# Altium schematic sheet mcu_power.SchDoc
size A4; DocumentNumber: 1; SheetNumber: 1; SheetTotal: 3
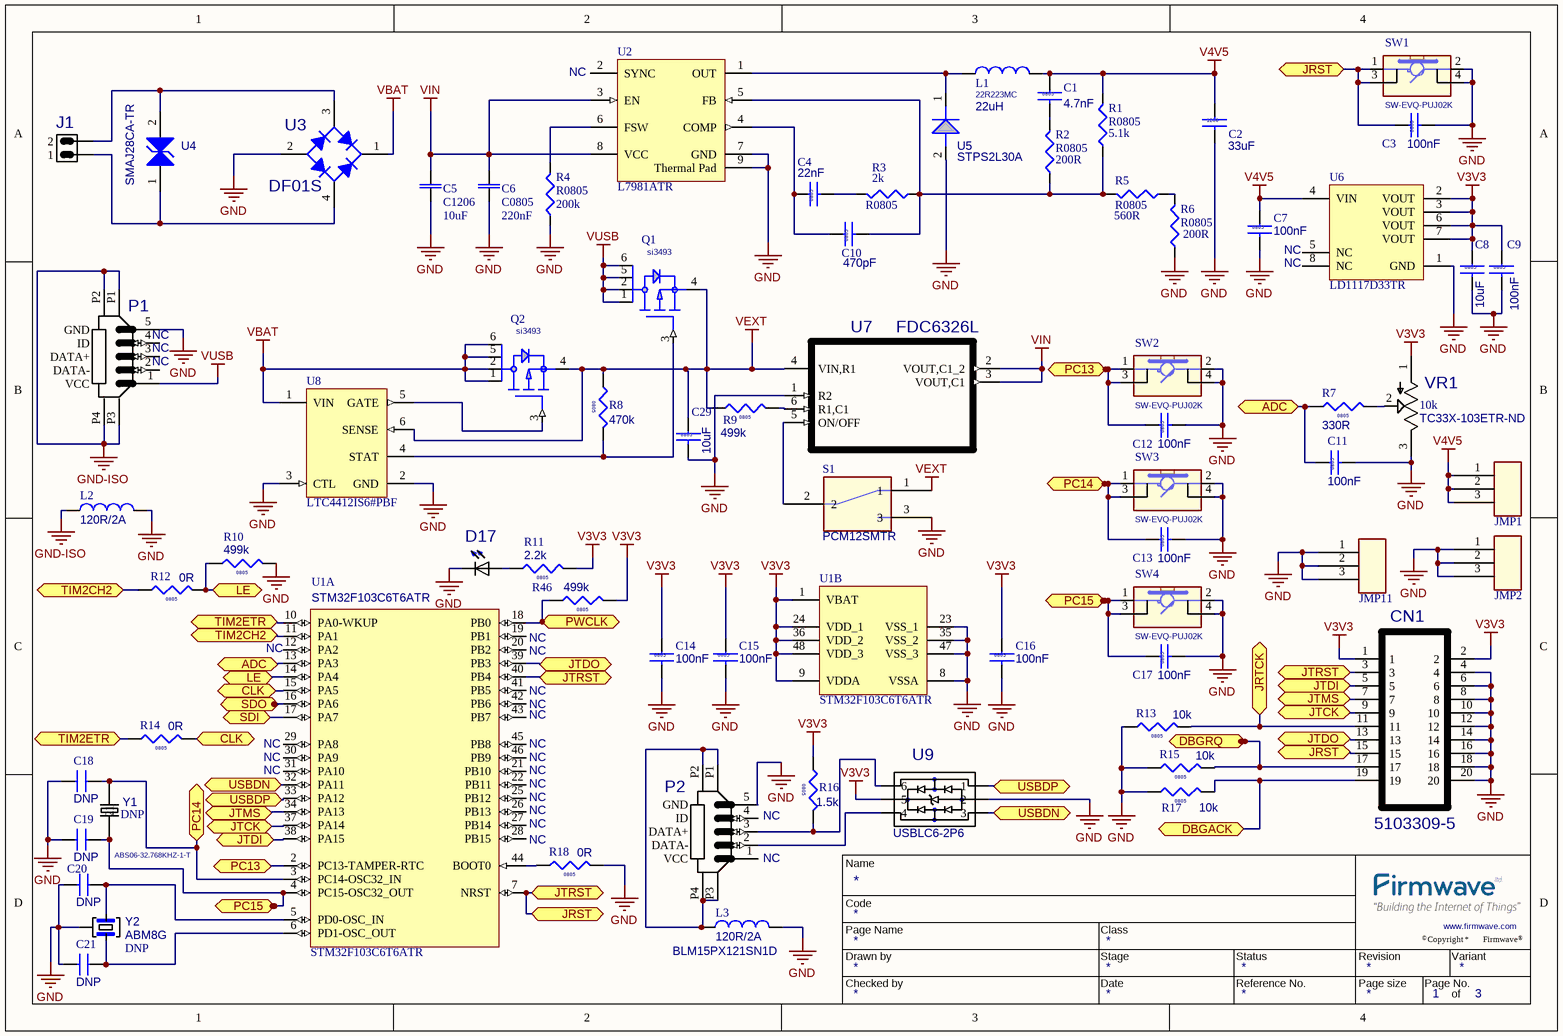
[diagram p0: mcu_power.SchDoc]

## Parts
C1  value 4.7nF  [C0805]  (hidden comment: EYLVWUPD)
C2  value 33uF  [C1206]  (hidden comment: ?)
C3  value 100nF  [C0805]  (hidden comment: GRM219R71C104KA01D)
C4  value 22nF  [C0805]  (hidden comment: ?)
C5  C1206  value 10uF  [C1206]
C6  C0805  value 220nF  [C0805]
C7  value 100nF  [C0805]  (hidden comment: GRM219R71C104KA01D)
C8  value 10uF  [C0805]  (hidden comment: GRM21BR61C106KE15L)
C9  value 100nF  [C0805]  (hidden comment: GRM219R71C104KA01D)
C10  value 470pF  [C0805]  (hidden comment: ?)
C11  value 100nF  [C0805]  (hidden comment: GRM219R71C104KA01D)
C12  value 100nF  [C0805]  (hidden comment: GRM219R71C104KA01D)
C13  value 100nF  [C0805]  (hidden comment: GRM219R71C104KA01D)
C14  value 100nF  [C0805]  (hidden comment: GRM219R71C104KA01D)
C15  value 100nF  [C0805]  (hidden comment: GRM219R71C104KA01D)
C16  value 100nF  [C0805]  (hidden comment: GRM219R71C104KA01D)
C17  value 100nF  [C0805]  (hidden comment: GRM219R71C104KA01D)
C18  value DNP  [0402]  (hidden comment: 0402)
C19  value DNP  [0402]  (hidden comment: 0402)
C20  value DNP  [0402]  (hidden comment: 0402)
C21  value DNP  [0402]  (hidden comment: 0402)
C29  value 10uF  [C0805]  (hidden comment: GRM21BR61C106KE15L)
CN1  5103309-5  [TYCO_5103309-5]
D17  LTST-C170KGKT  [DIOC200X125X110_LTST-C170KGKT(Primary)]  (value not drawn)
J1  640455-2  [2-PIN_CONNECTOR]  (value not drawn)
JMP1  JUMPER  [CON-HDR_3X1X254]  (value not drawn)
JMP2  JUMPER  [CON-HDR_3X1X254]  (value not drawn)
JMP11  JUMPER  [CON-HDR_3X1X254]  (value not drawn)
L1  22R223MC  value 22uH  [22R223MC]
L2  value 120R/2A  [0402]  (hidden comment: L0402)
L3  value 120R/2A  [0402]  (hidden comment: L0402)
P1  440247-2  [TE_440247-2]  (value not drawn)
P2  440247-2  [TE_440247-2]  (value not drawn)
Q1  si3493  [TSOP-6]
Q2  si3493  [TSOP-6]
R1  R0805  value 5.1k  [R0805]
R2  R0805  value 200R  [R0805]
R3  R0805  value 2k  [R0805]
R4  R0805  value 200k  [R0805]
R5  R0805  value 560R  [R0805]
R6  R0805  value 200R  [R0805]
R7  value 330R  [R0805]  (hidden comment: ?)
R8  value 470k  [R0805]  (hidden comment: ?)
R9  value 499k  [R0805]  (hidden comment: ?)
R10  value 499k  [R0805]  (hidden comment: ?)
R11  value 2.2k  [R0805]  (hidden comment: ?)
R12  value 0R  [R0805]  (hidden comment: ?)
R13  value 10k  [R0805]  (hidden comment: ?)
R14  value 0R  [R0805]  (hidden comment: ?)
R15  value 10k  [R0805]  (hidden comment: ?)
R16  value 1.5k  [R0805]  (hidden comment: ?)
R17  value 10k  [R0805]  (hidden comment: ?)
R18  value 0R  [R0805]  (hidden comment: ?)
R46  value 499k  [R0805]  (hidden comment: ?)
S1  SW_ON_OFF_Mini  [PCM12SMTR]  (value not drawn)
SW1  SW-EVQ-PUJ02K  [EVQPUJ02K]
SW2  SW-EVQ-PUJ02K  [EVQPUJ02K]
SW3  SW-EVQ-PUJ02K  [EVQPUJ02K]
SW4  SW-EVQ-PUJ02K  [EVQPUJ02K]
U1  STM32F103C6T6ATR  [STM-LQFP48_N]  (parts A,B of 2)
U2  L7981ATR  [HSOP8-D1_N]
U3  DF01S  [SOT508P985X260-4N]
U4  SMAJ28CA-TR  [DO-214AA]
U5  STPS2L30A  [DO-214AA]
U6  LD1117D33TR  [SO8_N]
U7  FDC6326L  [SOT95P280X110-6N]
U8  LTC4412IS6#PBF  [LT-S6-6-TSOT-23_N]
U9  USBLC6-2  [USBLC6-2P6]  (value not drawn)
VR1  value 10k  Supplier Part Number: TC33X-103ETR-ND  [TRIM_TC33X-2-103E]  (hidden comment: TC33X-2-103E)
Y1  ABS06-32.768KHZ-1-T  value DNP  [XTAL_ABS06-32.768KHZ-1-T]
Y2  ABM8G  value DNP  [ABM8G_ABM8G(Primary)]

## Ports
ADC, CLK, DBGACK, DBGRQ, JRST, JRTCK, JTCK, JTDI, JTDO, JTMS, JTRST, LE, PC13, PC14, PC15, PWCLK, SDI, SDO, TIM2CH2, TIM2ETR, USBDN, USBDP

## Nets
GND: C2.2 C3.2 C5.1 C6.1 C7.2 C8.2 C9.2 C11.2 C12.2 C13.2 C14.2 C15.2 C16.2 C17.2 C18.1 C19.1 C20.1 C21.1 C29.2 CN1.4 CN1.6 CN1.8 CN1.10 CN1.12 CN1.14 CN1.16 CN1.18 CN1.20 D17.1 JMP2.1 JMP2.2 JMP2.3 JMP11.1 JMP11.2 JMP11.3 L2.2 L3.2 P1.5(GND) P2.5(GND) R4.1 R6.1 R10.2 R13.1 R15.1 R17.1 R18.2 S1.3 SW1.2 SW1.4 SW2.2 SW2.4 SW3.2 SW3.4 SW4.2 SW4.4 U1.8(VSSA) U1.23(VSS_1) U1.35(VSS_2) U1.47(VSS_3) U2.7(GND) U2.9(Thermal_Pad) U3.2(A) U5.2(ANODE) U6.1(GND) U7.1(R2) U8.2(GND) U8.3(CTL) U9.2 VR1.3 Y2.2_4
GND-ISO: L2.1 P1.P1(GND) P1.P2(GND) P1.P3(GND) P1.P4(GND)
V3V3: C8.1 C9.1 C14.1 C15.1 C16.1 CN1.1 CN1.2 R11.2 R16.1 R46.2 U1.1(VBAT) U1.9(VDDA) U1.24(VDD_1) U1.36(VDD_2) U1.48(VDD_3) U6.2(VOUT) U6.3(VOUT) U6.6(VOUT) U6.7(VOUT) U9.5 VR1.1
V4V5: C1.1 C2.1 C7.1 JMP1.1 JMP1.2 JMP1.3 L1.2 R1.2 U6.4(VIN)
VBAT: Q2.1(D) Q2.2(D) Q2.5(D) Q2.6(D) U3.1(K) U8.1(VIN)
VEXT: C29.1 Q1.4(S) Q2.4(S) R8.1 R9.1 S1.1 U7.4(VIN,R1) U8.6(SENSE)
VIN: C5.2 C6.2 U2.3(EN) U2.8(VCC) U7.2(VOUT,C1_2) U7.3(VOUT,C1)
VUSB: P1.1(VCC) Q1.1(D) Q1.2(D) Q1.5(D) Q1.6(D)
ADC: C11.1 R7.1 U1.13(PA3) ; port ADC
CLK: R14.2 U1.15(PA5) ; port CLK
DBGACK: CN1.19 R17.2 ; port DBGACK
DBGRQ: CN1.17 R15.2 ; port DBGRQ
JRST: C3.1 CN1.3 CN1.15 SW1.1 SW1.3 U1.7(NRST) U1.40(PB4) ; port JTRST, port JRST
JRTCK: CN1.11 R13.2 ; port JRTCK
JTCK: CN1.9 U1.37(PA14) ; port JTCK
JTDI: CN1.5 U1.38(PA15) ; port JTDI
JTDO: CN1.13 U1.39(PB3) ; port JTDO
JTMS: CN1.7 U1.34(PA13) ; port JTMS
LE: R10.1 R12.2 U1.14(PA4) ; port LE
PC13: C12.1 SW2.1 SW2.3 U1.2(PC13-TAMPER-RTC) ; port PC13
PC14: C13.1 C18.2 SW3.1 SW3.3 U1.3(PC14-OSC32_IN) Y1.1 ; port PC14
PC15: C17.1 C19.2 SW4.1 SW4.3 U1.4(PC15-OSC32_OUT) Y1.2 ; port PC15
PWCLK: R46.1 U1.18(PB0) ; port PWCLK
SDI: U1.17(PA7) ; port SDI
SDO: U1.16(PA6) ; port SDO
TIM2CH2: R12.1 U1.11(PA1) ; port TIM2CH2
TIM2ETR: R14.1 U1.10(PA0-WKUP) ; port TIM2ETR
USBDN: U1.32(PA11) U9.3 ; port USBDN
USBDP: U1.33(PA12) U9.1 ; port USBDP
NetC1_2: C1.2 R2.2
NetC4_1: C4.1 C10.1 U2.4(COMP)
NetC4_2: C4.2 R3.2
NetC10_2: C10.2 R1.1 R2.1 R3.1 R5.2 U2.5(FB)
NetC20_2: C20.2 U1.5(PD0-OSC_IN) Y2.1
NetC21_2: C21.2 U1.6(PD1-OSC_OUT) Y2.3
NetD17_2: D17.2 R11.1
NetJ1_1: J1.1 U3.4(C) U4.1(C)
NetJ1_2: J1.2 U3.3(C) U4.2(C)
NetL1_1: L1.1 U2.1(OUT) U5.1(CATHODE)
NetL3_1: L3.1 P2.P1(GND) P2.P2(GND) P2.P3(GND) P2.P4(GND)
NetP2_2: P2.2(DATA-) U9.4
NetP2_3: P2.3(DATA+) R16.2 U9.6
NetQ1_3: Q1.3(G) R8.2 U8.4(STAT)
NetQ2_3: Q2.3(G) U8.5(GATE)
NetR4_2: R4.2 U2.6(FSW)
NetR5_1: R5.1 R6.2
NetR7_2: R7.2 VR1.2
NetR9_2: R9.2 U7.6(R1,C1)
NetR18_1: R18.1 U1.44(BOOT0)
NetS1_2: S1.2 U7.5(ON/OFF)

Not connected (* = marked no-connect by the designer): P1 2(DATA-) 3(DATA+) 4(ID); P2 1(VCC) 4(ID); U1 12(PA2) 19(PB1) 20(PB2) 21(PB10) 22(PB11) 25(PB12) 26(PB13) 27(PB14) 28(PB15) 29(PA8) 30(PA9) 31(PA10) 41(PB5) 42(PB6) 43(PB7) 45(PB8) 46(PB9); U2 2(SYNC); U6 5(NC) 8(NC)

## Notes on the sheet
- (near U2) NC
- NC
- (near P1) NC
- (near U1) NC
- (near P2) NC
- Name
- Code
- Page Name
- Drawn by
- Checked by
- Class
- Stage
- Date
- Status
- Reference No.
- Revision
- Page size
- ©
- Page No.
- Copyright
- www.firmwave.com
- Variant
- Firmwave
- ®
- of
- (in symbol CAP0805) 0805
- (in symbol CAP1206) 1206

## Library data of the parts
C1 = CAP0805: Manufacturer Part Number: JMK212BJ476MG-T; Manufacturer: Taiyo Yuden; Voltage - Rated: 6.3V; Tolerance: ±20%; Temperature Coefficient: X5R; Capacitance: 47µF; PARTTYPE: CAP0805; Applications: General Purpose; Category: Capacitors; Failure Rate: *; Supplier: Digi-Key; Lead Spacing: -; RoHS: RoHS Compliant; Height - Seated (Max): -; Part Status: Active; Ratings: -; Thickness (Max): 0.053" (1.35mm); Package / Case: 0805 (2012 Metric); Operating Temperature: -55°C ~ 85°C; Packaging: Tape & Reel (TR); Mounting Type: Surface Mount, MLCC; Size / Dimension: 0.079" L x 0.049" W (2.00mm x 1.25mm); Features: -; Supplier Part Number: 587-1779-2-ND; Lead Style: -
C2 = CAP1206: SELC PartNumber: SE; Manufacturer: TDK Corporation; Manufacturer Part Number: C3216X5R1C336M160AB; Tolerance: ±20%; Temperature Coefficient: X5R; Voltage - Rated: 16V; Capacitance: 33µF; PARTTYPE: CAP1206; Failure Rate: -; Lead Spacing: -; Thickness (Max): 0.071" (1.80mm); Lead Style: -; Package / Case: 1206 (3216 Metric); Mounting Type: Surface Mount, MLCC; Height - Seated (Max): -; Applications: General Purpose; Size / Dimension: 0.126" L x 0.063" W (3.20mm x 1.60mm); Category: Capacitors; Supplier Part Number: 445-6002-2-ND; Supplier: Digi-Key; Ratings: -; Features: Low ESL; RoHS: RoHS Compliant; Packaging: Tape & Reel (TR); Part Status: Active; Operating Temperature: -55°C ~ 85°C
C3 C7 C9 C11-C17 = CAP0805: Manufacturer: Murata Electronics North America; Tolerance: ±10%; Voltage - Rated: 16V; Capacitance: 0.10µF; Temperature Coefficient: X7R; PARTTYPE: CAP0805; Thickness (Max): 0.037" (0.95mm); Lead Spacing: -; Height - Seated (Max): -; Lead Style: -; Category: Capacitors; Size / Dimension: 0.079" L x 0.049" W (2.00mm x 1.25mm); RoHS: RoHS Compliant; Features: -; Operating Temperature: -55°C ~ 125°C; Ratings: -; Supplier: Digi-Key; Package / Case: 0805 (2012 Metric); Supplier Part Number: 490-1683-2-ND; Part Status: Active; Manufacturer Part Number: GRM219R71C104KA01D; Failure Rate: *; Packaging: Tape & Reel (TR); Mounting Type: Surface Mount, MLCC; Applications: General Purpose
C4 = CAP0805: Manufacturer Part Number: QMK212B7223KG-T; Manufacturer: Taiyo Yuden; voltage_rating_dc: 250.0; pin_count: 2; capacitance_tolerance: ±10%; dielectric_characteristic: X7R; capacitance: 2.2e-08; dielectric_material: Ceramic; PARTTYPE: CAP0805; rohs_status: Compliant; Supplier: Octopart; Seller Landing  Url: https://octopart.com/click/track?country=PL&ak=8157f166&sig=019f8d3&sid=459&ppid=7073011&vpid=34089162&ct=offers; Supplier Part Number: Digi-Key - 587-1272-1-ND; Manufacturer Part Detail Url: https://octopart.com/click/track?country=PL&ak=8157f166&ct=hyperlinks&sig=081e5d1&sid=18954&ppid=7073011&hlid=9478301; case_package: 0805; Octopart Url: http://octopart.com/qmk212b7223kg-t-taiyo+yuden-7073011; OctopartID: 2a3ee35fe3abf5f9; halogen_free_status: Halogen Free; lifecycle_status: Active
C5 = C1206: Capacitor 1206; Manufacturer: TDK Corporation; Manufacturer Part Number: C3216X5R1H106K160AB; Voltage - Rated: 50V; Tolerance: ±10%; Capacitance: 10µF; Temperature Coefficient: X5R; Published: 14-Jun-2016; LatestRevisionDate: 29-May-2009; LatestRevisionNote: IPC-7351 Footprint Added.; PackageReference: C1206; Publisher: Firmwave Ltd.; PackageDescription: Chip Capacitor; Part Status: Active; Lead Style: -; Category: Capacitors; Operating Temperature: -55°C ~ 85°C; Height - Seated (Max): -; Failure Rate: -; Applications: General Purpose; Thickness (Max): 0.071" (1.80mm); Mounting Type: Surface Mount, MLCC; Packaging: Tape & Reel (TR); Size / Dimension: 0.126" L x 0.063" W (3.20mm x 1.60mm); Lead Spacing: -; Features: Low ESL; Ratings: -; Supplier: Digi-Key; Package / Case: 1206 (3216 Metric); RoHS: RoHS Compliant; Supplier Part Number: 445-5998-2-ND
C6 = C0805: Capacitor 0805; Manufacturer: Taiyo Yuden; Manufacturer Part Number: UMK212B7224KG-T; Voltage - Rated: 50V; Capacitance: 0.22µF; Temperature Coefficient: X7R; Tolerance: ±10%; Published: 8-Jun-2000; LatestRevisionDate: 29-May-2009; LatestRevisionNote: IPC-7351 Footprint Added.; PackageReference: C0805; Publisher: Firmwave Ltd.; PackageDescription: Chip Capacitor; Operating Temperature: -55°C ~ 125°C; Lead Style: -; Lead Spacing: -; Packaging: Tape & Reel (TR); Mounting Type: Surface Mount, MLCC; Failure Rate: *; RoHS: RoHS Compliant; Supplier Part Number: 587-1287-2-ND; Thickness (Max): 0.053" (1.35mm); Ratings: -; Category: Capacitors; Package / Case: 0805 (2012 Metric); Size / Dimension: 0.079" L x 0.049" W (2.00mm x 1.25mm); Features: -; Supplier: Digi-Key; Part Status: Active; Height - Seated (Max): -
C8 C29 = CAP0805: Manufacturer: Murata Electronics North America; Capacitance: 10µF; Temperature Coefficient: X5R; Voltage - Rated: 16V; Tolerance: ±10%; PARTTYPE: CAP0805; Lead Spacing: -; Package / Case: 0805 (2012 Metric); Size / Dimension: 0.079" L x 0.049" W (2.00mm x 1.25mm); Thickness (Max): 0.053" (1.35mm); Height - Seated (Max): -; Mounting Type: Surface Mount, MLCC; Lead Style: -; Ratings: -; Packaging: Tape & Reel (TR); Failure Rate: *; RoHS: RoHS Compliant; Part Status: Active; Applications: General Purpose; Operating Temperature: -55°C ~ 85°C; Features: -; Manufacturer Part Number: GRM21BR61C106KE15L; Category: Capacitors; Supplier: Digi-Key; Supplier Part Number: 490-3886-2-ND
C10 = CAP0805: Manufacturer Part Number: MM051A471JCT2A; Manufacturer: AVX; PARTTYPE: CAP0805; Octopart Url: http://octopart.com/mm051a471jct2a-avx-76677498; Seller Landing  Url: https://octopart.com/click/track?country=PL&ak=8157f166&sig=000a973&sid=2401&ppid=76677498&vpid=277180285&ct=offers; Supplier: Octopart; Supplier Part Number: Mouser - 581-MM051A471JCT2A; OctopartID: 7939b4a15d25a6fe
C18-C21 = C0402_0: Ceramic capacitor/SMT0603/16V/20%; Part: 200xxx; Package: 0402; Decal: 0402
CN1 = 5103309-5: Header; Pin; Vertical; Copper Alloy; Thermoplastic; 20; 0.100 x 0.100 in.; 1 A; MF: TE Connectivity / AMP; MP: 5103309-5; Price: 1.49 USD; Availability: Good; Package: None; Value: *
D17 = LTST-C170KGKT: Green 2 x 1.25 x 1.1 mm 130Â° Water Clear 35 mcd 2 V Surface Mount LED; Manufacturer Part Number: LTST-C170KRKT; MF: Lite-On; MP: LTST-C170KGKT; Price: 0.10 USD; Availability: Good; Package: 0805 Lite-On; Value: *; Manufacturer: Lite-On; RoHS: No; Supplier: Allied; Supplier Part Number: R1038165
J1 = 640455-2: MTA-100 2 Position 2.54 mm Single Row Right Angle Wire to Board Header; MF: TE Connectivity / AMP; Package: None; MP: 640455-2; Availability: Good; Price: 0.05 USD; Value: *
JMP1 JMP2 JMP11 = CON-HDR_3X1X254: PARTTYPE: CON-HDR_3X1X254
L1 = 22R223MC: Manufacturer: Murata Power Solutions; pin_count: 2; inductance: 2.2e-05; packaging: Tape & Reel (TR); Seller Landing  Url: https://octopart.com/click/track?country=PL&ak=8157f166&sig=09f8fcf&sid=459&ppid=49447512&vpid=146941984&ct=offers; OctopartID: 6766ac9ec058b8a1; Octopart Url: http://octopart.com/22r223mc-murata+power+solutions-49447512; Supplier: Octopart; rohs_status: Compliant; Supplier Part Number: Digi-Key - 811-2426-6-ND; Manufacturer Part Number: 22R223MC
L2 L3 = IND0402: BLM15PX121SN1D; SELC PartNumber: SE?; Manufacturer: Murata Electronics North America; Number of Lines: 1; Current Rating (Max): 2A; Filter Type: Power Line; DC Resistance (DCR) (Max): 55 mOhm; Impedance @ Frequency: 120 Ohm @ 100MHz; PARTTYPE: IND00402; PARTYPE: L0402; FOOTPRINT: 0402CS; Size / Dimension: 0.039" L x 0.020" W (1.00mm x 0.50mm); Supplier: Digi-Key; Packaging: Tape & Reel (TR); Package / Case: 0402 (1005 Metric); Mounting Type: Surface Mount; Part Status: Active; Height (Max): 0.022" (0.55mm); Ratings: -; Supplier Part Number: 490-9656-2-ND; Manufacturer Part Number: BLM15PX121SN1D; Operating Temperature: -55°C ~ 125°C; RoHS: RoHS Compliant; Category: Filters
P1 P2 = 440247-2: Universal Serial Bus (USB) Connectors Product Highlights: USB Type = Mini 1 Ports Number of Positions = 5 Right Angle...; Manufacturer: TE Connectivity AMP Connectors; MF: Micross; Connector Type: USB - mini B; Specifications: USB 2.0; Number of Contacts: 5; Number of Ports: 1; Gender: Receptacle; Material Flammability Rating: UL94 V-0; Package: None; MP: 440247-2; Availability: Unavailable; Price: None; Value: *; Contact Finish: Gold; Termination: Solder; Mounting Type: Surface Mount, Right Angle; Part Status: Obsolete; Voltage - Rated: -; Insulation Color: Black; Category: Connectors, Interconnects; Shielding: -; Packaging: Tape & Reel (TR); Shell/Shielding Material: Phosphor Bronze; Operating Temperature: -; Mounting Feature: Horizontal; Features: Board Guide, Solder Retention; RoHS: RoHS non-compliant; Mating Cycles: -; Ingress Protection: -; Supplier Part Number: 440247-2-ND; Supplier: Digi-Key; Current Rating: -; Manufacturer Part Number: 440247-2
Q1 Q2 = SI3493DBV: Manufacturer Part Number: SI3493BDV-T1-E3; Manufacturer: Vishay Siliconix; Vgs(th) (Max) @ Id: 900mV @ 250µA; Power - Max: 2.97W; FET Feature: Standard; Current - Continuous Drain (Id) @ 25°C: 8A (Tc); Rds On (Max) @ Id, Vgs: 27.5 mOhm @ 7A, 4.5V; Drain to Source Voltage (Vdss): 20V; Gate Charge (Qg) @ Vgs: 43.5nC @ 5V; Input Capacitance (Ciss) @ Vds: 1805pF @ 10V; FET Type: MOSFET P-Channel, Metal Oxide; Mounting Type: Surface Mount; Operating Temperature: -55°C ~ 150°C (TJ); Supplier Device Package: 6-TSOP; Package / Case: SOT-23-6 Thin, TSOT-23-6; Supplier: Digi-Key; Part Status: Active; RoHS: RoHS Compliant; Category: Discrete Semiconductor Products; Packaging: Tape & Reel (TR); Supplier Part Number: SI3493BDV-T1-E3TR-ND
R1 = R0805: Manufacturer: Panasonic Electronic Components; Manufacturer Part Number: ERJ-6GEYJ512V; Temperature Coefficient: ±200ppm/°C; Power (Watts): 0.125W, 1/8W; Tolerance: ±5%; Published: 14-Jun-2016; LatestRevisionDate: 29-May-2009; LatestRevisionNote: IPC-7351 Footprint Added.; PackageReference: 0805; Publisher: Firmwave Limited; PackageDescription: Chip Resistor; Failure Rate: -; Number of Terminations: 2; Features: Automotive AEC-Q200; Packaging: Tape & Reel (TR); Size / Dimension: 0.079" L x 0.049" W (2.00mm x 1.25mm); Supplier Part Number: P5.1KATR-ND; Category: Resistors; Supplier Device Package: 0805; Package / Case: 0805 (2012 Metric); RoHS: RoHS Compliant; Part Status: Active; Resistance (Ohms): 5.1k; Supplier: Digi-Key; Operating Temperature: -55°C ~ 155°C; Height - Seated (Max): 0.028" (0.70mm); Composition: Thick Film
R2 = R0805: Manufacturer: Panasonic Electronic Components; Manufacturer Part Number: ERJ-6GEYJ201V; Tolerance: ±5%; Power (Watts): 0.125W, 1/8W; Temperature Coefficient: ±200ppm/°C; Resistance (Ohms): 200; Published: 14-Jun-2016; LatestRevisionDate: 29-May-2009; LatestRevisionNote: IPC-7351 Footprint Added.; PackageReference: 0805; Publisher: Firmwave Limited; PackageDescription: Chip Resistor; Supplier: Digi-Key; Composition: Thick Film; Features: Automotive AEC-Q200; Supplier Part Number: P200ATR-ND; Size / Dimension: 0.079" L x 0.049" W (2.00mm x 1.25mm); Package / Case: 0805 (2012 Metric); Number of Terminations: 2; Failure Rate: -; Category: Resistors; Packaging: Tape & Reel (TR); Supplier Device Package: 0805; Part Status: Active; RoHS: RoHS Compliant; Height - Seated (Max): 0.028" (0.70mm); Operating Temperature: -55°C ~ 155°C
R3 = R0805: Manufacturer Part Number: ERJ-6GEYJ202V; Manufacturer: Panasonic Electronic Components; Temperature Coefficient: ±200ppm/°C; Tolerance: ±5%; Power (Watts): 0.125W, 1/8W; Published: 14-Jun-2016; LatestRevisionDate: 29-May-2009; LatestRevisionNote: IPC-7351 Footprint Added.; PackageReference: 0805; Publisher: Firmwave Limited; PackageDescription: Chip Resistor; Operating Temperature: -55°C ~ 155°C; Number of Terminations: 2; Features: Automotive AEC-Q200; Package / Case: 0805 (2012 Metric); Supplier Device Package: 0805; Size / Dimension: 0.079" L x 0.049" W (2.00mm x 1.25mm); Height - Seated (Max): 0.028" (0.70mm); Failure Rate: -; Supplier Part Number: P2.0KATR-ND; Category: Resistors; Supplier: Digi-Key; Composition: Thick Film; RoHS: RoHS Compliant; Resistance (Ohms): 2k; Part Status: Active; Packaging: Tape & Reel (TR)
R4 = R0805: Manufacturer: Panasonic Electronic Components; Manufacturer Part Number: ERJ-6GEYJ204V; Power (Watts): 0.125W, 1/8W; Temperature Coefficient: ±200ppm/°C; Tolerance: ±5%; Published: 14-Jun-2016; LatestRevisionDate: 29-May-2009; LatestRevisionNote: IPC-7351 Footprint Added.; PackageReference: 0805; Publisher: Firmwave Limited; PackageDescription: Chip Resistor; Packaging: Tape & Reel (TR); Supplier Device Package: 0805; Features: Automotive AEC-Q200; Operating Temperature: -55°C ~ 155°C; Size / Dimension: 0.079" L x 0.049" W (2.00mm x 1.25mm); Category: Resistors; Number of Terminations: 2; Supplier Part Number: P200KATR-ND; Failure Rate: -; Part Status: Active; Package / Case: 0805 (2012 Metric); Resistance (Ohms): 200k; Composition: Thick Film; Supplier: Digi-Key; RoHS: RoHS Compliant; Height - Seated (Max): 0.028" (0.70mm)
R5 = R0805: Manufacturer: Panasonic Electronic Components; Manufacturer Part Number: ERJ-6GEYJ561V; Temperature Coefficient: ±200ppm/°C; Power (Watts): 0.125W, 1/8W; Resistance (Ohms): 560; Tolerance: ±5%; Published: 14-Jun-2016; LatestRevisionDate: 29-May-2009; LatestRevisionNote: IPC-7351 Footprint Added.; PackageReference: 0805; Publisher: Firmwave Limited; PackageDescription: Chip Resistor; Number of Terminations: 2; Package / Case: 0805 (2012 Metric); Failure Rate: -; Size / Dimension: 0.079" L x 0.049" W (2.00mm x 1.25mm); Height - Seated (Max): 0.028" (0.70mm); Supplier Device Package: 0805; RoHS: RoHS Compliant; Composition: Thick Film; Supplier: Digi-Key; Features: Automotive AEC-Q200; Category: Resistors; Packaging: Tape & Reel (TR); Supplier Part Number: P560ATR-ND; Operating Temperature: -55°C ~ 155°C; Part Status: Active
R6 = R0805: Manufacturer: Panasonic; Manufacturer Part Number: ERJ-6ENF2200V; Published: 14-Jun-2016; LatestRevisionDate: 29-May-2009; LatestRevisionNote: IPC-7351 Footprint Added.; PackageReference: 0805; Publisher: Firmwave Limited; PackageDescription: Chip Resistor; Supplier: Allied; RoHS: No; Supplier Part Number: 70265276
R7 = RES0805: Manufacturer Part Number: ERJ-6GEYJ331V; Manufacturer: Panasonic Electronic Components; Tolerance: ±5%; Temperature Coefficient: ±200ppm/°C; Power (Watts): 0.125W, 1/8W; Resistance (Ohms): 330; PARTTYPE: RES0805; Features: Automotive AEC-Q200; Height - Seated (Max): 0.028" (0.70mm); Number of Terminations: 2; Failure Rate: -; Packaging: Tape & Reel (TR); Composition: Thick Film; Package / Case: 0805 (2012 Metric); Operating Temperature: -55°C ~ 155°C; Supplier: Digi-Key; RoHS: RoHS Compliant; Part Status: Active; Size / Dimension: 0.079" L x 0.049" W (2.00mm x 1.25mm); Supplier Part Number: P330ATR-ND; Category: Resistors; Supplier Device Package: 0805
R8 = RES0805: Manufacturer Part Number: RCV0805470KJNEA; Manufacturer: Vishay BC Components; Power (Watts): 0.125W, 1/8W; Tolerance: ±5%; Temperature Coefficient: ±200ppm/°C; PARTTYPE: RES0805; Number of Terminations: 2; Height - Seated (Max): 0.020" (0.50mm); Package / Case: 0805 (2012 Metric); Part Status: Active; Features: High Voltage; Supplier: Digi-Key; Supplier Part Number: BC2819TR-ND; Failure Rate: -; Size / Dimension: 0.079" L x 0.049" W (2.00mm x 1.25mm); Packaging: Tape & Reel (TR); Category: Resistors; Supplier Device Package: 0805; RoHS: RoHS Compliant; Operating Temperature: -55°C ~ 155°C; Resistance (Ohms): 470k; Composition: Thick Film
R9 R10 R46 = RES0805: Manufacturer: Rohm Semiconductor; Manufacturer Part Number: KTR10EZPF4993; Temperature Coefficient: ±100ppm/°C; Tolerance: ±1%; Power (Watts): 0.125W, 1/8W; PARTTYPE: RES0805; Number of Terminations: 2; Resistance (Ohms): 499k; RoHS: RoHS Compliant; Features: Automotive AEC-Q200, High Voltage; Operating Temperature: -55°C ~ 155°C; Supplier Device Package: 0805; Category: Resistors; Supplier Part Number: RHM499KAHTR-ND; Height - Seated (Max): 0.026" (0.65mm); Supplier: Digi-Key; Part Status: Active; Package / Case: 0805 (2012 Metric); Size / Dimension: 0.079" L x 0.049" W (2.00mm x 1.25mm); Failure Rate: -; Composition: Thick Film; Packaging: Tape & Reel (TR)
R11 = RES0805: Manufacturer: Vishay; Manufacturer Part Number: CRCW08052K20FKEA; Temperature Coefficient: ±100ppm/°C; Tolerance: ±1%; Power (Watts): 0.125W, 1/8W; case_package_si: 2012; lead_free_status: Lead Free; pin_count: 2; size_height: 0.00045; power_rating: 0.125; voltage_rating_dc: 150.0; size_length: 0.002; size_width: 0.00125; resistance: 2200.0; mounting_style: Surface Mount; temperature_coefficient: 100.0; PARTTYPE: RES0805; Number of Terminations: 2; Resistance (Ohms): 2.2k; RoHS: RoHS Compliant; Features: Automotive AEC-Q200, High Voltage; Operating Temperature: -55°C ~ 155°C; Supplier Device Package: 0805; Category: Resistors; Supplier Part Number: Avnet - CRCW08052K20FKEA; Height - Seated (Max): 0.026" (0.65mm); Supplier: Octopart; Part Status: Active; Package / Case: 0805 (2012 Metric); Size / Dimension: 0.079" L x 0.049" W (2.00mm x 1.25mm); Failure Rate: -; Composition: Thick Film; Packaging: Tape & Reel (TR); OctopartID: 624ea91b4b46bd89; reach_svhc_compliance: No SVHC; rohs_status: Compliant; case_package: 0805; Octopart Url: http://octopart.com/crcw08052k20fkea-vishay-39783534; Seller Landing  Url: https://octopart.com/click/track?country=PL&ak=8157f166&sig=05a669e&sid=5822&ppid=39783534&vpid=257760359&ct=offers; resistance_tolerance: ±1%
R12 R14 R18 = RES0805: Manufacturer Part Number: CRCW08050000Z0EA; Manufacturer: Vishay Dale; Resistance (Ohms): 0.0; Power (Watts): 0.125W, 1/8W; Tolerance: Jumper; PARTTYPE: RES0805; Number of Terminations: 2; Supplier: Digi-Key; Supplier Device Package: 0805; Height - Seated (Max): 0.020" (0.50mm); Composition: Thick Film; Packaging: Tape & Reel (TR); RoHS: RoHS Compliant; Part Status: Active; Operating Temperature: -55°C ~ 155°C; Package / Case: 0805 (2012 Metric); Supplier Part Number: 541-0.0ATR-ND; Temperature Coefficient: -; Features: Automotive AEC-Q200; Size / Dimension: 0.079" L x 0.049" W (2.00mm x 1.25mm); Category: Resistors; Failure Rate: -
R13 R15 R17 = RES0805: Manufacturer Part Number: CRCW080510K0FKEA; Manufacturer: Vishay Dale; Tolerance: ±1%; Power (Watts): 0.125W, 1/8W; Temperature Coefficient: ±100ppm/°C; PARTTYPE: RES0805; Resistance (Ohms): 10k; Composition: Thick Film; Part Status: Active; Size / Dimension: 0.079" L x 0.049" W (2.00mm x 1.25mm); Category: Resistors; Supplier Part Number: 541-10.0KCTR-ND; Number of Terminations: 2; Packaging: Tape & Reel (TR); Height - Seated (Max): 0.020" (0.50mm); Package / Case: 0805 (2012 Metric); Supplier Device Package: 0805; RoHS: RoHS Compliant; Features: Automotive AEC-Q200; Operating Temperature: -55°C ~ 155°C; Supplier: Digi-Key; Failure Rate: -
R16 = RES0805: Manufacturer: Vishay Dale; Manufacturer Part Number: CRCW08051K50FKEA; Power (Watts): 0.125W, 1/8W; Tolerance: ±1%; Temperature Coefficient: ±100ppm/°C; PARTTYPE: RES0805; Composition: Thick Film; Category: Resistors; Supplier: Digi-Key; Operating Temperature: -55°C ~ 155°C; Supplier Part Number: 541-1.50KCTR-ND; RoHS: RoHS Compliant; Failure Rate: -; Size / Dimension: 0.079" L x 0.049" W (2.00mm x 1.25mm); Packaging: Tape & Reel (TR); Number of Terminations: 2; Supplier Device Package: 0805; Package / Case: 0805 (2012 Metric); Resistance (Ohms): 1.5k; Height - Seated (Max): 0.020" (0.50mm); Part Status: Active; Features: Automotive AEC-Q200
S1 = SW_ON_OFF_Mini: Manufacturer: C&K; Actuator Length: 1.50mm; Voltage Rating - DC: 6V; Actuator Type: Standard; Switch Function: On-On; Circuit: SPDT; Mechanical Life: 10,000 Cycles; Actuator Material: Polyamide (PA46), Nylon 4/6; Contact Timing: Not Specified; Current Rating: 300mA (DC); RoHS: RoHS Compliant; Mounting Type: Surface Mount, Right Angle; Voltage Rating - AC: -; Manufacturer Part Number: PCM12SMTR; Operating Temperature: -20°C ~ 85°C; Termination Style: Gull Wing; Features: -; Category: Switches; Part Status: Active; Contact Finish: Silver; Electrical Life: -; Switch Travel: 1.50mm; Operating Force: -; Supplier Part Number: 401-2016-2-ND; Contact Material: Copper Alloy; Supplier: Digi-Key; Packaging: Tape & Reel (TR)
SW1-SW4 = SW-EVQ-PUJ02K: EVQ-PUJ02K; Manufacturer: Panasonic Electronic Components; Outline: 4.70mm x 3.50mm; Switch Function: Off-Mom; Switch Travel: 0.30mm; Illumination: Non-Illuminated; Circuit: SPST-NO; Mechanical Life: 100,000 Cycles; Contact Rating @ Voltage: 0.05A @ 12VDC; Actuator Type: Rectangular Button; Actuator Orientation: Side Actuated; Operating Force: 160gf; Illumination Voltage (Nominal): -; Termination Style: Gull Wing; Supplier: Digi-Key; Illumination Type, Color: -; Mounting Type: Surface Mount, Right Angle; Supplier Part Number: P10851SDKR-ND; Category: Switches; Manufacturer Part Number: EVQ-PUJ02K; Actuator Material: -; Features: -; Packaging: Digi-Reel®; Actuator Height off PCB, from Pins: -; Operating Temperature: -20°C ~ 70°C; Ingress Protection: -; RoHS: RoHS Compliant; Part Status: Active
U1 = STM32F103C6T6ATR: ARM Cortex-M3 32-bit MCU, 32 KB Flash, 10 KB Internal RAM, 37 I/Os, 48-pin LQFP, -40 to 85 degC, Tape and Reel; Manufacturer: STMicroelectronics; A/D Converter: 2x12-bit (10 Channel); FLASH Size (Prog) (kB): 32; I/Os (High Current): 37; Internal RAM Size (kB): 10; Operating Frequency(F) (Processor speed) (MHz): 72; Supply Voltage(Vcc) min (V): 2; lead_free_status: Lead Free; DatasheetVersion: Rev. 6; PackageVersion: Rev. 6, 06/2013; PackageReference: LQFP48; PackageDescription: 48-Pin Low Profile Quad Flat Package, 7 x 7 mm Body, 0.5 mm Pitch; Supplier 1: Digi-Key; Supplier Part Number 1: STM32F103C6T6ATR-ND; Supplier 2: Mouser; Supplier Part Number 2: 511-STM32F103C6T6ATR; Core: ARM Cortex-M3; Packing: Tape and Reel; Mounting Technology: Surface Mount; PartNumber: STM32F103C6T6ATR; ComponentLink1Description: Manufacturer URL; ComponentLink1URL: http://www.st.com/web/en/home.html; ComponentLink2Description: Datasheet; ComponentLink2URL: http://www.st.com/st-web-ui/static/active/en/resource/technical/document/datasheet/CD00210843.pdf; ComponentLink3Description: Package Specification; ComponentLink3URL: http://www.st.com/st-web-ui/static/active/en/resource/technical/document/datasheet/DM00058181.pdf; OctopartID: 9fe65638a3034021; Manufacturer Part Detail Url: https://octopart.com/click/track?country=PL&ak=8157f166&ct=hyperlinks&sig=01879c1&sid=355&ppid=13900163&hlid=1716682; Manufacturer Part Number: STM32F103C6T6ATR; Seller Landing  Url: https://octopart.com/click/track?country=PL&ak=8157f166&sig=07dfb4e&sid=13512&ppid=13900163&vpid=120452185&ct=offers; lifecycle_status: Active; Supplier Part Number: Chip One Stop Japan - STMI-0082568; Supplier: Octopart; rohs_status: Compliant; Octopart Url: http://octopart.com/stm32f103c6t6atr-stmicroelectronics-13900163
U2 = L7981ATR: 3 A step-down switching regulator, 8-Pin HSOP, Tape and Reel; Manufacturer: STMicroelectronics; lead_free_status: Lead Free; DatasheetVersion: Jul-2010; PackageVersion: 2010; PackageReference: HSOP8-D1; PackageDescription: 8-Pin Small Outline Integrated Circuit 1.27 mm Pitch; ComponentLink1Description: Manufacturer URL; ComponentLink1URL: http://www.st.com; ComponentLink2Description: Datasheet; ComponentLink2URL: http://www.st.com/internet/com/TECHNICAL_RESOURCES/TECHNICAL_LITERATURE/DATASHEET/CD00217474.pdf; lifecycle_status: Active; Seller Landing  Url: https://octopart.com/click/track?country=PL&ak=8157f166&sig=044a10f&sid=2401&ppid=18824421&vpid=37742441&ct=offers; OctopartID: 35adfdb82c2eea6a; Supplier: Octopart; Manufacturer Part Number: L7981ATR; Octopart Url: http://octopart.com/l7981atr-stmicroelectronics-18824421; Supplier Part Number: Mouser - 511-L7981ATR; rohs_status: Compliant; Manufacturer Part Detail Url: https://octopart.com/click/track?country=PL&ak=8157f166&ct=hyperlinks&sig=0dde51f&sid=355&ppid=18824421&hlid=24996990
U3 = DF01S: Power Management, Bridge Rectifiers, Semiconductors and Actives; Manufacturer: Vishay Semiconductor; Manufacturer Part Number: DF01S-E3/77; MF: International Rectifier; mounting_style: Surface Mount; lead_free_status: Lead Free; pin_count: 4; Price: None; MP: DF01S; Availability: Unavailable; Package: None; Value: *; Seller Landing  Url: https://octopart.com/click/track?country=PL&ak=8157f166&sig=0a277ee&sid=1106&ppid=42173311&vpid=118987822&ct=offers; OctopartID: 1cb4d73dbaadc373; Supplier: Octopart; Supplier Part Number: Arrow - DF01S-E3/77; rohs_status: Compliant; Octopart Url: http://octopart.com/df01s-e3%2F77-vishay+semiconductor-42173311
U4 = SMAJ28CA-TR: Manufacturer: STMICROELECTRONICS; Supplier 1: Farnell; Supplier Part Number 1: 9802800; Supplier Part Number: 2252451; RoHS: YES; Supplier: Farnell; Manufacturer Part Number: SMAJ28CA-TR
U5 = STPS2L30A: MANUFACTURER: NXP Semiconductors; MPN: BGU7005; PACKAGE: None; Value: *; PARTTYPE: *; SUPPLIER: Farnell; Supplier Part Number: 2400498; Supplier 1: Digi-Key; FOOTPRINT: *; Supplier Part Number 1: 497-3759-6-ND
U6 = LD1117D33TR: Fixed Low Drop Positive Voltage Regulator, 3.3V, 8-Pin SO, Tape and Reel; Manufacturer Part Number: STPS2L30A; Manufacturer: STMicroelectronics; lead_free_status: Lead Free; pin_count: 2; current_rating: 2.0; forward_voltage: 0.45; voltage_rating_dc: 30.0; mounting_style: Surface Mount; polarity: Standard; DatasheetVersion: Nov-2011; PackageVersion: Dec-2002; PackageReference: SO8; PackageDescription: 8-Pin Small Outline Integrated Circuit 1.27 mm Pitch; PartNumber: LD1117D33TR; Code_JEDEC: MS-012-AA; Code_IPC: SOIC127P600-8; ComponentLink1Description: Manufacturer URL; ComponentLink1URL: http://www.st.com; ComponentLink2Description: Datasheet; ComponentLink2URL: http://www.st.com/internet/com/TECHNICAL_RESOURCES/TECHNICAL_LITERATURE/DATASHEET/CD00000544.pdf; ComponentLink3Description: Package Specification; ComponentLink3URL: http://www.st.com/internet/com/TECHNICAL_RESOURCES/TECHNICAL_LITERATURE/PACKAGE_INFORMATION/CD00004680.pdf; Octopart Url: http://octopart.com/stps2l30a-stmicroelectronics-324369; rohs_status: Compliant; reach_svhc_compliance: No SVHC; Manufacturer Part Detail Url: https://octopart.com/click/track?country=PL&ak=8157f166&ct=hyperlinks&sig=091bb51&sid=355&ppid=324369&hlid=25008853; OctopartID: 573a9e34814d88fd; Supplier: Octopart; packaging: Cut Tape (CT); Supplier Part Number: Mouser - 511-STPS2L30A; lifecycle_status: Active; Seller Landing  Url: https://octopart.com/click/track?country=PL&ak=8157f166&sig=0bb1f00&sid=2401&ppid=324369&vpid=37600629&ct=offers
U7 = FDC6326L: FDC6326L Series 20 V 0.125 Ohm Surface Mount Integrated Load Switch -SuperSOT-6; Manufacturer Part Number: FDC6331L; MF: Fairchild Semiconductor; Ratio - Input:Output: 1:1; Rds On (Typ): 34 mOhm; Switch Type: General Purpose; Output Type: P-Channel; Input Type: Non-Inverting; Output Configuration: High Side; Current - Output (Max): 2.8A; Voltage - Load: 2.5 V ~ 8 V; Interface: On/Off; Number of Outputs: 1; Package: None; MP: FDC6326L; Availability: Good; Price: 0.29 USD; Value: *; Category: Integrated Circuits (ICs); Supplier: Digi-Key; Manufacturer: Fairchild Semiconductor; Supplier Device Package: SuperSOT™-6; Packaging: Tape & Reel (TR); Package / Case: SOT-23-6 Thin, TSOT-23-6; RoHS: RoHS Compliant; Part Status: Active; Features: -; Fault Protection: -; Operating Temperature: -55°C ~ 150°C (TJ); Voltage - Supply (Vcc/Vdd): -; Supplier Part Number: FDC6331LTR-ND
U8 = LTC4412IS6#PBF: Low Loss PowerPath(TM) Controller, 2.5 to 28 V Vin, 6-pin SOT23 (S6-6), -40 to 85 degC, Pb-Free; Manufacturer: Linear Technology; Ideal Diode: Single, External, P-Channel; PackageVersion: Jun-10; PackageReference: S6-6; PackageDescription: 6-Pin Plastic TSOT-23, Body 2.9 x 1.63 mm, Pitch 0.95 mm; Supplier 1: Farnell; Supplier Part Number 1: 1858719; Supplier 2: Newark; Supplier Part Number 2: 69R7373; RoHS: TRUE; Mounting Technology: Surface Mount; Code_JEDEC: MO-193; PartNumber: LTC4412IS6#PBF; ComponentLink1Description: Manufacturer URL; ComponentLink1URL: http://www.linear.com/; ComponentLink2Description: Datasheet; ComponentLink2URL: http://cds.linear.com/docs/en/datasheet/4412fa.pdf; ComponentLink3Description: Package Specification; ComponentLink3URL: http://cds.linear.com/docs/en/packaging/SOT_6_05-08-1636.pdf
U9 = USBLC6-2: Very Low Capacitance Esd Protection; MF: STMicroelectronics; Voltage - Breakdown (Min): 6V; Voltage - Reverse Standoff (Typ): 5.25V; Voltage - Clamping (Max) @ Ipp: 17V; Power Line Protection: Yes; Current - Peak Pulse (10/1000µs): 5A (8/20µs); Unidirectional Channels: 2; Availability: Unavailable; Price: None; Package: None; MP: USBLC6-2; Value: *; Supplier 1: Octopart; Supplier Part Number 1: Digi-Key - 497-5026-2-ND; Mounting Type: Surface Mount; Power - Peak Pulse: -; RoHS: RoHS Compliant; Manufacturer: STMicroelectronics; Bidirectional Channels: -; Capacitance @ Frequency: -; Supplier: Digi-Key; Category: Circuit Protection; Part Status: Active; Manufacturer Part Number: USBLC6-2P6; Operating Temperature: -40°C ~ 125°C (TJ); Applications: Ethernet; Supplier Device Package: SOT-666; Packaging: Digi-Reel®; Type: Steering (Rail to Rail); Package / Case: SOT-563, SOT-666; Supplier Part Number: 497-5026-6-ND
VR1 = TC33X-2-103E: Res Trimmer 10K Ohm 25% 0.1W(1/10W) 1(Elec)/1(Mech)Turn (3 X 3.8mm) Foot Print SMD Embossed T/R; Manufacturer: Bourns Inc.; MF: Bourns; Number of Turns: 1; Power (Watts): 0.1W, 1/10W; Temperature Coefficient: ±250ppm/°C; Resistive Material: Cermet; Adjustment Type: Top Adjustment; MP: TC33X-2-103E; Price: 0.14 USD; Availability: Good; Package: None; RoHS: RoHS Compliant; Manufacturer Part Number: TC33X-2-103E; Mounting Type: Surface Mount; Tolerance: ±25%; Resistance (Ohms): 10k; Supplier: Digi-Key; Category: Potentiometers, Variable Resistors; Part Status: Active; Packaging: Tape & Reel (TR); Size / Dimension: Rectangular - 0.150" x 0.142" Face x 0.047" H (3.80mm x 3.60mm x 1.20mm); Termination Style: J Lead